# EAGLE design LED-Treiber1 (EAGLE 9.6.2)
PWM LED Treiber mit NE555 und MosFET
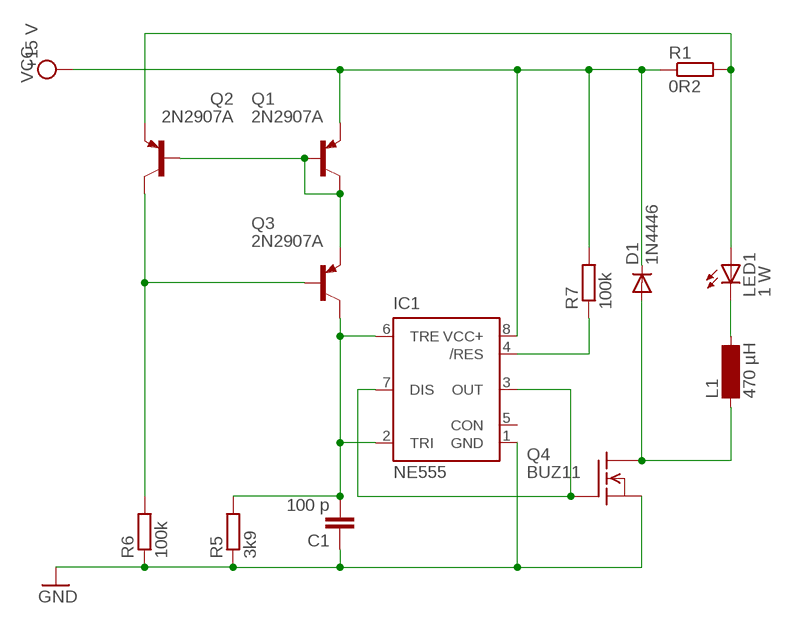
[diagram p0: schematic, sheet 1]

## Parts
C1  100 p  C2,5-3  [C2.5-3]
D1  1N4446  [DO35-10]
IC1  NE555  [DIL-08]
L1  470 µH  MS85  [MS85]
LED1  1 W  LED5MM  [LED5MM]
Q1  2N2907A  [TO18]
Q2  2N2907A  [TO18]
Q3  2N2907A  [TO18]
Q4  BUZ11  [TO220]
R1  0R2  R-EU_0207/10  [0207/10]
R5  3k9  R-EU_0207/10  [0207/10]
R6  100k  R-EU_0207/10  [0207/10]
R7  100k  R-EU_0207/10  [0207/10]

## Nets
GND: C1.1 IC1.1(GND) Q4.3(S) R5.1 R6.1
N$1: Q1.2(B) Q1.3(C) Q2.2(B) Q3.1(E)
N$2: C1.2 IC1.2(TRI) IC1.6(TRE) Q3.3(C) R5.2
N$3: Q2.3(C) Q3.2(B) R6.2
N$4: IC1.3(OUT) IC1.7(DIS) Q4.1(G)
N$7: IC1.4(/RES) R7.1
N$8: D1.A L1.1 Q4.2(D)
N$9: L1.2 LED1.K(C)
N$10: LED1.A Q2.1(E) R1.2
VCC: D1.C IC1.8(VCC+) Q1.1(E) R1.1 R7.2
Unconnected: IC1.5(CON)

## Library data of the parts
C1 = capacitor-wima:C: CAPACITOR naming: grid - package width
D1 = diode:1N4446: DIODE high speed (Philips)
IC1 = st-microelectronics:NE555: General purpose bipolar Timer; MF: Arrow Electronics; MPN: NE555N; OC_FARNELL: 1467742; OC_NEWARK: 89K1486
L1 = inductor-neosid:MS85: INDUCTOR SMD power inductor; OC_FARNELL: unknown; OC_NEWARK: unknown
LED1 = led:LED: LED OSRAM: - CHIPLED LG R971, LG N971, LY N971, LG Q971, LY Q971, LO R971, LY R971 LH N974, LH R974 LS Q976, LO Q976, LY Q976 LO Q996 - Hyper CHIPLED LW Q18S LB Q993, LB Q99A, LB R99A - SideLED LS A670, LO A670, LY A670, LG A670, LP A670 LB A673, LV A673, LT A673, LW A673 LH A674 LY A675 LS A676, LA A676, LO A676, LY A676, LW A676 LS A679, LY A679, LG A679 - Hyper Micro SIDELED® LS Y876, LA Y876, LO Y876, LY Y876 LT Y87S - SmartLED LW L88C, LW L88S LB L89C, LB L89S, LG L890 LS L89K, LO L89K, LY L89K LS L896, LA L896, LO L896, LY L896 - TOPLED LS T670, LO T670, LY T670, LG T670, LP T670 LSG T670, LSP T670, LSY T670, LOP T670, LYG T670 LG T671, LOG T671, LSG T671 LB T673, LV T673, LT T673, LW T673 LH T674 LS T676, LA T676, LO T676, LY T676, LB T676, LH T676, LSB T676, LW T676 LB T67C, LV T67C, LT T67C, LS T67K, LO T67K, LY T67K, LW E67C LS E67B, LA E67B, LO E67B, LY E67B, LB E67C, LV E67C, LT E67C LW T67C LS T679, LY T679, LG T679 LS T770, LO T770, LY T770, LG T770, LP T770 LB T773, LV T773, LT T773, LW T773 LH T774 LS E675, LA E675, LY E675, LS T675 LS T776, LA T776, LO T776, LY T776, LB T776 LHGB T686 LT T68C, LB T68C - Hyper Mini TOPLED® LB M676 - Mini TOPLED Santana® LG M470 LS M47K, LO M47K, LY M47K Source: http://www.osram.convergy.de LUXEON: - LUMILED® LXK2-PW12-R00, LXK2-PW12-S00, LXK2-PW14-U00, LXK2-PW14-V00 LXK2-PM12-R00, LXK2-PM12-S00, LXK2-PM14-U00 LXK2-PE12-Q00, LXK2-PE12-R00, LXK2-PE12-S00, LXK2-PE14-T00, LXK2-PE14-U00 LXK2-PB12-K00, LXK2-PB12-L00, LXK2-PB12-M00, LXK2-PB14-N00, LXK2-PB14-P00, LXK2-PB14-Q00 LXK2-PR12-L00, LXK2-PR12-M00, LXK2-PR14-Q00, LXK2-PR14-R00 LXK2-PD12-Q00, LXK2-PD12-R00, LXK2-PD12-S00 LXK2-PH12-R00, LXK2-PH12-S00 LXK2-PL12-P00, LXK2-PL12-Q00, LXK2-PL12-R00 Source: www.luxeon.com KINGBRIGHT: KA-3528ASYC Source: www.kingbright.com
Q1-Q3 = transistor-pnp:2N2907*: PNP Transistor
Q4 = transistor-fet:BUZ11: N-Channel Enhancement MOSFET 50V; 30A; 0,040Ohm
R1 R5-R7 = resistor:R-EU_: RESISTOR, European symbol

## Board
PWM LED Treiber mit NE555 und MosFET
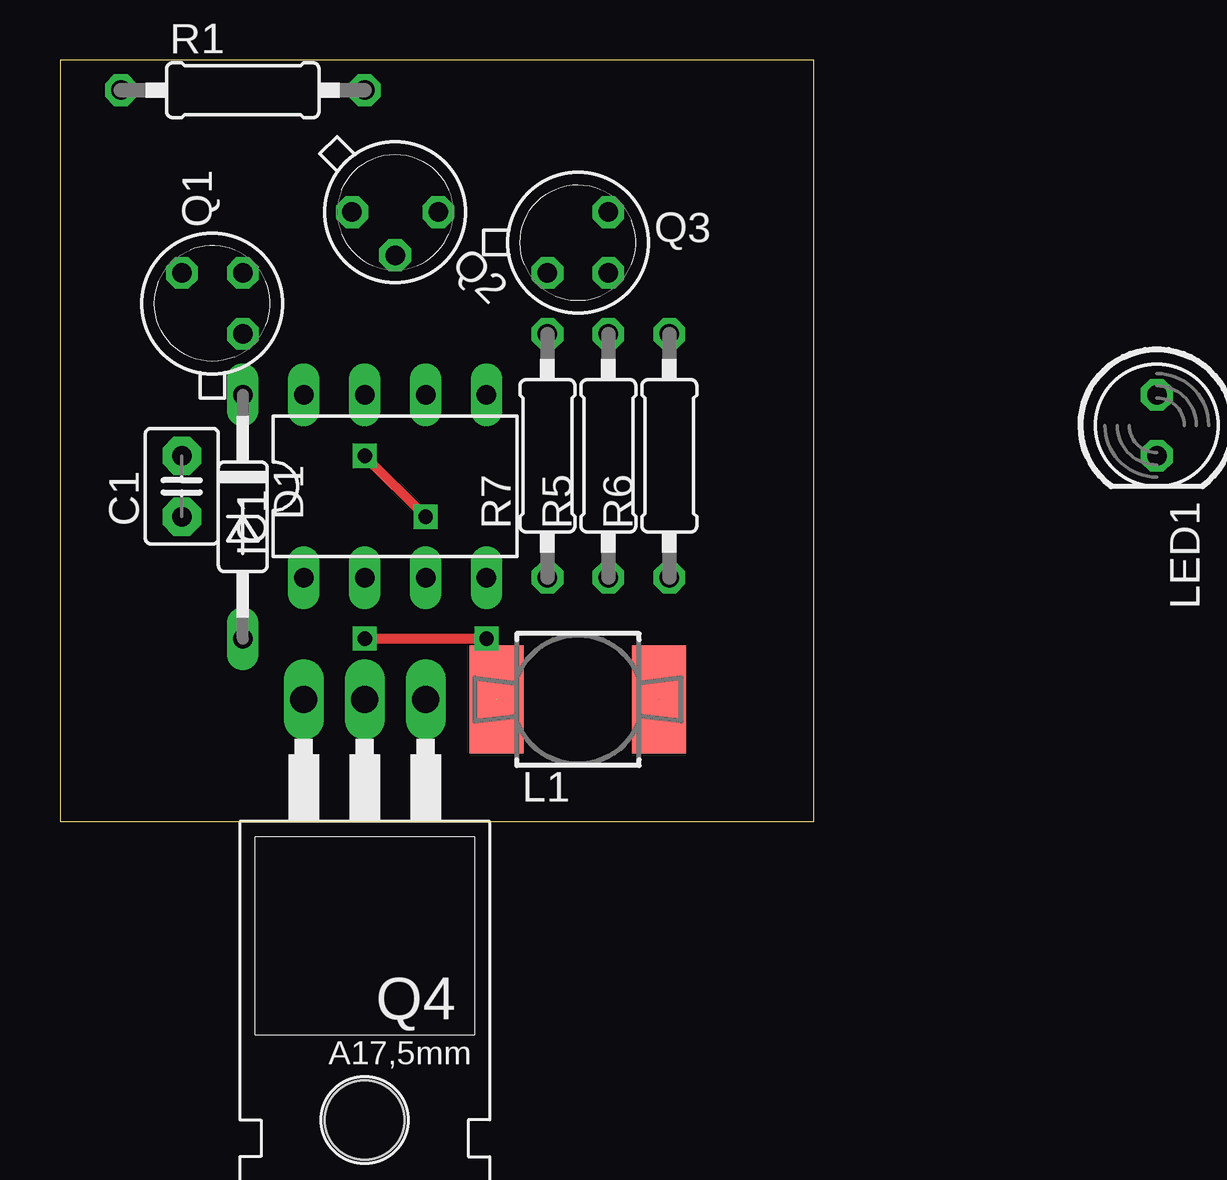
[diagram p1: board, top side]
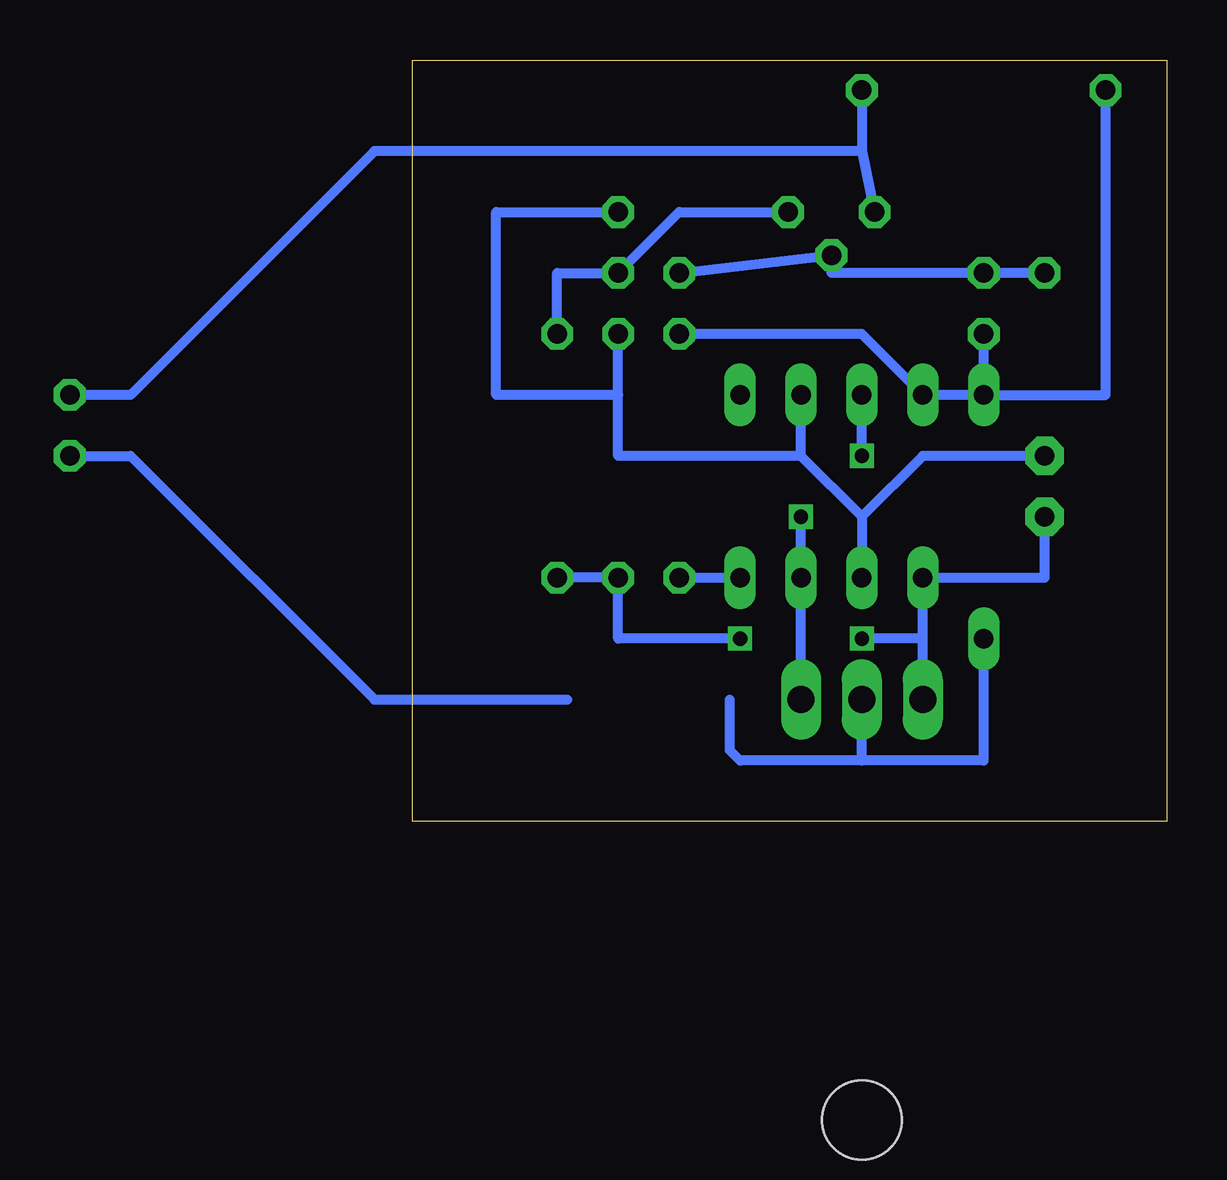
[diagram p2: board, bottom side, seen from below]

Size 31.42 x 31.74 mm. Coordinates in mm from the lower left corner, seen from the top.
Outline: 0,0 31.42,0 31.42,31.74 0,31.74 0,0
Copper layers (1*16): Top 0.035mm / dielectric 1.5mm / Bottom 0.035mm
Design rules: minimum track width 10mil, minimum drill 24mil, track to track 8mil, track to pad 8mil, pad to pad 8mil, via to via 8mil, smd to smd 8mil, copper to edge 40mil, drill to drill 8mil, minimum pad ring 10mil, minimum via ring 8mil, stop-mask expansion 4mil, vias tented up to drill 0mil, thermal gap 10mil

### Footprints (pad centres in the part's own frame; a part is rotated, then mirrored left to right if it is on the bottom)
C2.5-3 = drill 0.813 pad 1.6 octagon: 1 -1.27,0; 2 1.27,0
DO35-10 = drill 0.813 long: A 5.08,0; C -5.08,0
DIL-08 = drill 0.813 long: 1 -3.81,-3.81; 2 -1.27,-3.81; 3 1.27,-3.81; 4 3.81,-3.81; 5 3.81,3.81; 6 1.27,3.81; 7 -1.27,3.81; 8 -3.81,3.81
MS85 = smd 4.5 x 2.25: 1 0,-3.383; 2 0,3.383
LED5MM = drill 0.813 octagon: A -1.27,0; K 1.27,0
TO18 = drill 0.813 octagon: 1 -1.27,-1.27; 2 1.27,-1.27; 3 1.27,1.27
TO220 = drill 1.118 long: 1 -2.54,-6.35; 2 0,-6.35; 3 2.54,-6.35 | hole 3.302: 0,11.176
0207/10 = drill 0.813 octagon: 1 -5.08,0; 2 5.08,0

### Placement (x,y rotation side)
C1  5.08,13.97 90 top
D1  7.62,12.7 270 top
IC1  13.97,13.97 0 top
L1  21.59,5.08 270 top
LED1  45.72,16.51 270 top  (outside the outline)
Q1  6.35,21.59 90 top
Q2  13.97,25.4 315 top
Q3  21.59,24.13 0 top
Q4  12.7,-1.27 180 top
R1  7.62,30.48 0 top
R5  22.86,15.24 90 top
R6  25.4,15.24 90 top
R7  20.32,15.24 90 top

### Tracks (layer width: path | path; a pad name or v marks a point on that pad's centre or on a via)
GND  (via drill 0.6)
  Top 0.406: v12.7,7.62 v17.78,7.62
  Bottom 0.406: R6.1 R5.1 22.86,7.62 v17.78,7.62 | Q4.3 10.16,7.62 | 10.16,7.62 IC1.1 5.08,10.16 C1.1 | 10.16,7.62 v12.7,7.62
N$1
  Bottom 0.406: Q1.3 Q1.2 13.97,22.86 Q2.2 Q3.1
N$2
  Bottom 0.406: 12.7,12.7 IC1.2 | 12.7,12.7 15.24,15.24 | 15.24,15.24 22.86,15.24 22.86,17.78 | 22.86,17.78 R5.2 | 15.24,15.24 IC1.6 | C1.2 10.16,15.24 12.7,12.7 | 22.86,17.78 27.94,17.78 27.94,25.4 Q3.3
N$3
  Bottom 0.406: R6.2 25.4,22.86 Q3.2 20.32,25.4 Q2.3
N$4  (via drill 0.6)
  Top 0.406: v12.7,15.24 v15.24,12.7
  Bottom 0.406: v12.7,15.24 IC1.7 | v15.24,12.7 IC1.3 Q4.1
N$7
  Bottom 0.406: R7.1 IC1.4
N$8  (1 unrouted)
  Bottom 0.406: 12.7,2.54 Q4.2 | D1.A 7.62,2.54 12.7,2.54 | 12.7,2.54 17.78,2.54 18.21,2.97 L1.1
N$9  (1 unrouted)
  Bottom 0.406: LED1.K 43.18,15.24 33.02,5.08 L1.2
N$10
  Bottom 0.406: LED1.A 43.18,17.78 33.02,27.94 12.7,27.94 | R1.2 12.7,27.94 | 12.7,27.94 Q2.1
VCC
  Bottom 0.406: D1.C IC1.8 12.7,20.32 R7.2 | D1.C Q1.1 | D1.C 2.54,17.78 R1.1